# Altium schematic sheet all.SchDoc
size A4
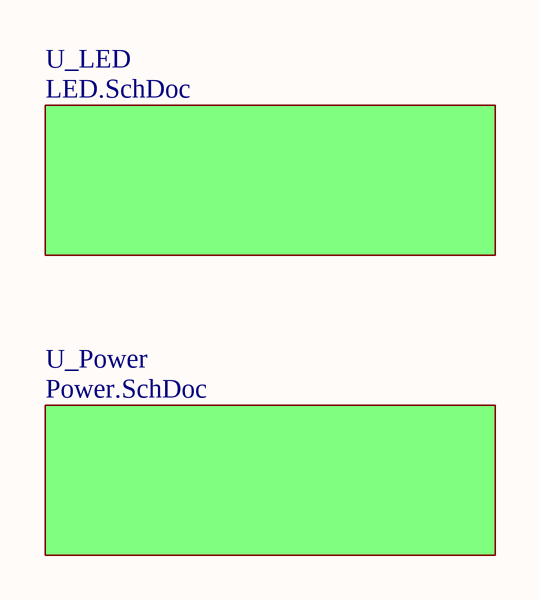
[diagram p0: all.SchDoc]

## Sub-sheets
U_LED = LED.SchDoc: no entries
U_Power = Power.SchDoc: no entries